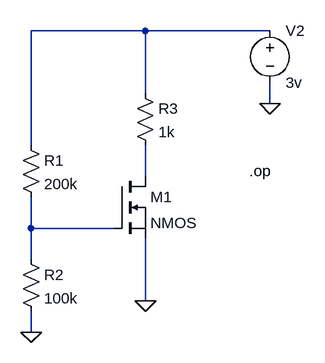
[diagram p0: schematic task2.asc]
task2.asc, the LTspice schematic file:
Version 4
SHEET 1 880 680
WIRE 288 48 112 48
WIRE 480 48 288 48
WIRE 288 144 288 48
WIRE 480 160 480 128
WIRE 112 224 112 48
WIRE 288 272 288 224
WIRE 112 352 112 304
WIRE 240 352 112 352
WIRE 112 400 112 352
WIRE 288 464 288 368
WIRE 112 512 112 480
FLAG 480 160 0
FLAG 288 464 0
FLAG 112 512 0
SYMBOL nmos 240 272 R0
SYMATTR InstName M1
SYMBOL Res 96 208 R0
SYMATTR InstName R1
SYMATTR Value 200k
SYMBOL Res 96 384 R0
SYMATTR InstName R2
SYMATTR Value 100k
SYMBOL Res 272 128 R0
SYMATTR InstName R3
SYMATTR Value 1k
SYMBOL Voltage 480 32 R0
SYMATTR InstName V2
SYMATTR Value 3v
TEXT 448 264 Left 2 !.op

The netlist it stands for:
* task2.asc
M1 N002 N003 0 0 NMOS
R1 N001 N003 200k
R2 N003 0 100k
R3 N001 N002 1k
V2 N001 0 3v
.model NMOS NMOS
.model PMOS PMOS
.lib standard.mos
.op
.backanno
.end